# EAGLE design M040X (EAGLE 6.6.0)
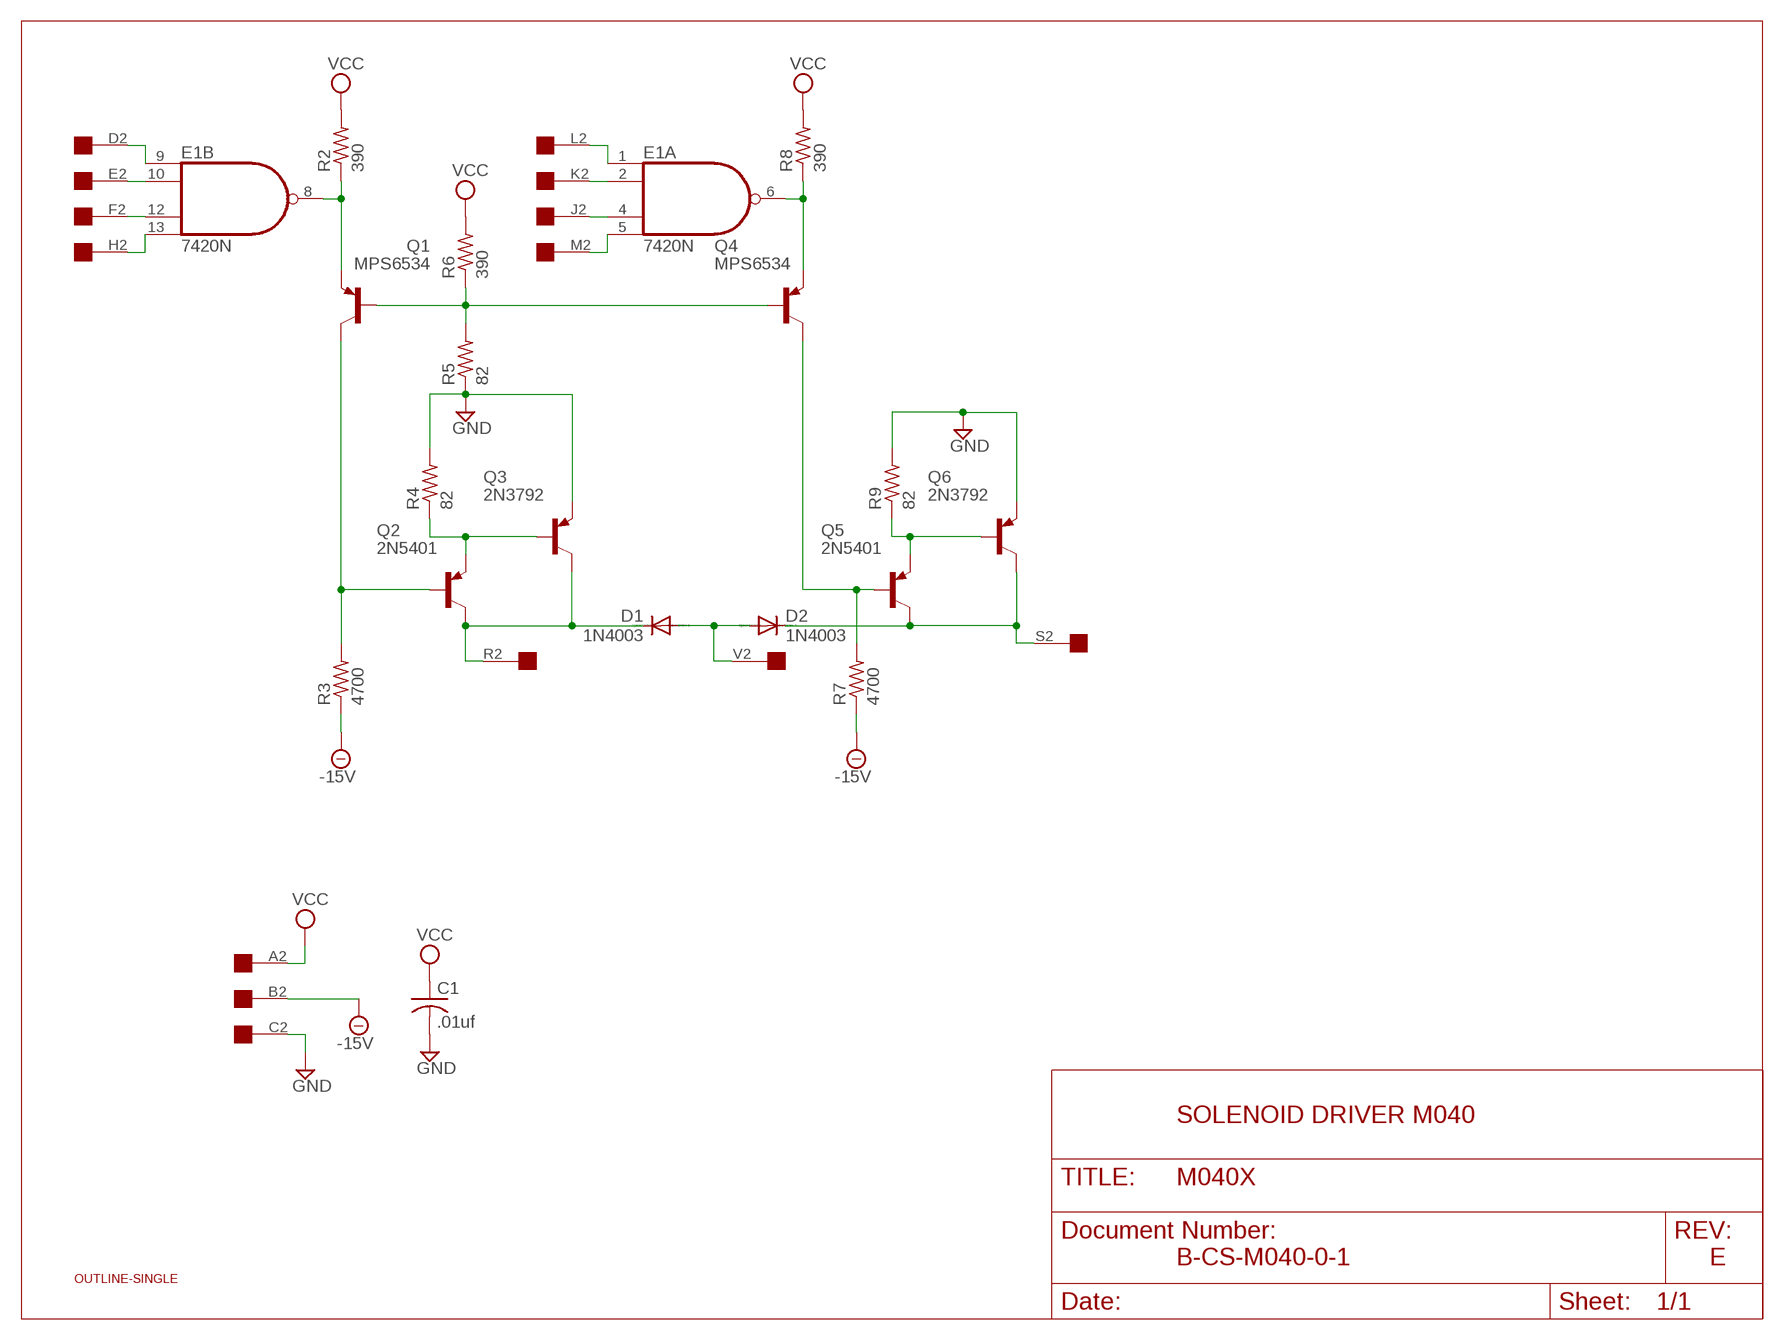
[diagram p0: schematic, sheet 1]

## Parts
C1  .01uf  C-US050-025X075  [C050-025X075]
D1  1N4003  1N4004  [DO41-10]
D2  1N4003  1N4004  [DO41-10]
E1  7420N  74S20N  [DIL14]
Q1  MPS6534  2N2904-PNP-TO39-EBC  [TO39]
Q2  2N5401  2N2904-PNP-TO39-EBC  [TO39]
Q3  2N3792  -PNP-TO3  [TO3]
Q4  MPS6534  2N2904-PNP-TO39-EBC  [TO39]
Q5  2N5401  2N2904-PNP-TO39-EBC  [TO39]
Q6  2N3792  -PNP-TO3  [TO3]
R2  390  R-US_0207/10  [0207/10]
R3  4700  R-US_0207/10  [0207/10]
R4  82  R-US_0207/10  [0207/10]
R5  82  R-US_0207/10  [0207/10]
R6  390  R-US_0207/10  [0207/10]
R7  4700  R-US_0207/10  [0207/10]
R8  390  R-US_0207/10  [0207/10]
R9  82  R-US_0207/10  [0207/10]
U$1  OUTLINE-SINGLE  [SINGLE]
U$2  EDGE-1  [EDGE-CON1]

## Nets
-15V [Supply]: R3.1 R7.1 U$2.B2
GND [Supply]: C1.2 Q3.E Q6.E R4.2 R5.1 R9.2 U$2.C2
N$1: E1.10(B:I1) U$2.E2
N$2: E1.12(B:I2) U$2.F2
N$3: E1.13(B:I3) U$2.H2
N$4: E1.9(B:I0) U$2.D2
N$5: E1.1(A:I0) U$2.L2
N$6: E1.2(A:I1) U$2.K2
N$7: E1.4(A:I2) U$2.J2
N$8: E1.5(A:I3) U$2.M2
N$9: E1.8(B:O) Q1.1(E) R2.1
N$10: Q1.2(B) Q4.2(B) R5.2 R6.1
N$11: E1.6(A:O) Q4.1(E) R8.1
N$12: Q1.3(C) Q2.2(B) R3.2
N$13: Q4.3(C) Q5.2(B) R7.2
N$14: Q2.1(E) Q3.B R4.1
N$16: D1.C Q2.3(C) Q3.C U$2.R2
N$17: Q5.1(E) Q6.B R9.1
N$18: D2.C Q5.3(C) Q6.C U$2.S2
N$19: D1.A D2.A U$2.V2
VCC [Supply]: C1.1 R2.2 R6.2 R8.2 U$2.A2
Unconnected: U$2.N2 U$2.P2 U$2.T2 U$2.U2

## Notes on the sheet
- SOLENOID DRIVER M040
- B-CS-M040-0-1 | E

## Power pins joined to a net without a drawn wire
GND: E1.7(P:GND)
VCC: E1.14(P:VCC)

## Library data of the parts
C1 = rcl:C-US: CAPACITOR, American symbol
D1 D2 = diode:1N4004: DIODE general purpose rectifier, 1 A
E1 = 74xx-us:74*20: Dual 4-input NAND gate
Q1-Q6 = transistor:*-PNP-: PNP Transistror
R2-R9 = rcl:R-US_: RESISTOR, American symbol
U$1 = dec-con:OUTLINE-*: Board outlines for DEC boards.
U$2 = dec-con:EDGE-1: Single-Sided DEC Edge Connector -- (side 2)

## Net classes
1 Supply: width 0.813 mm

## Board
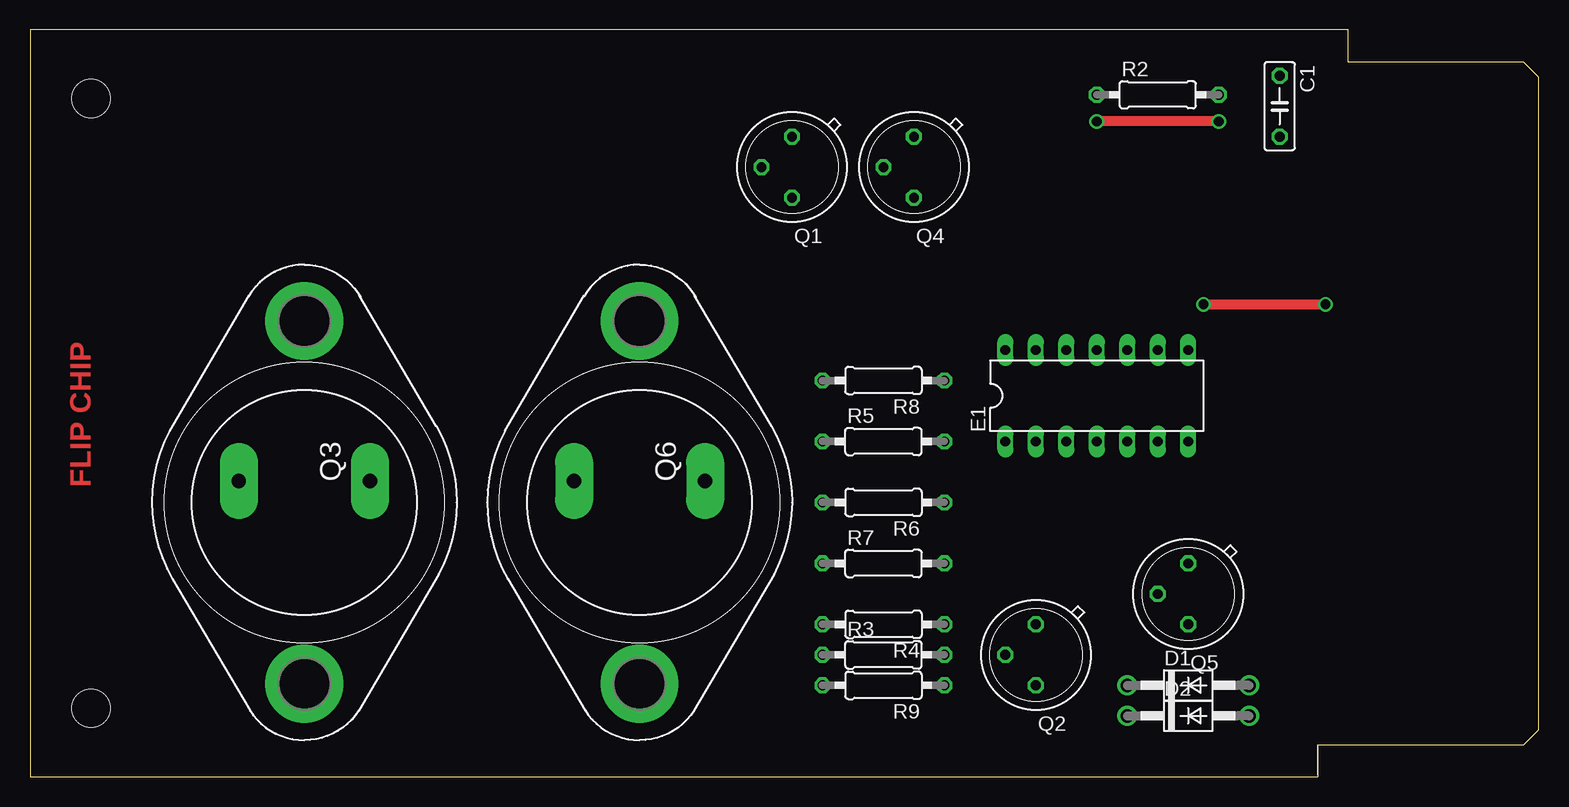
[diagram p1: board, top side]
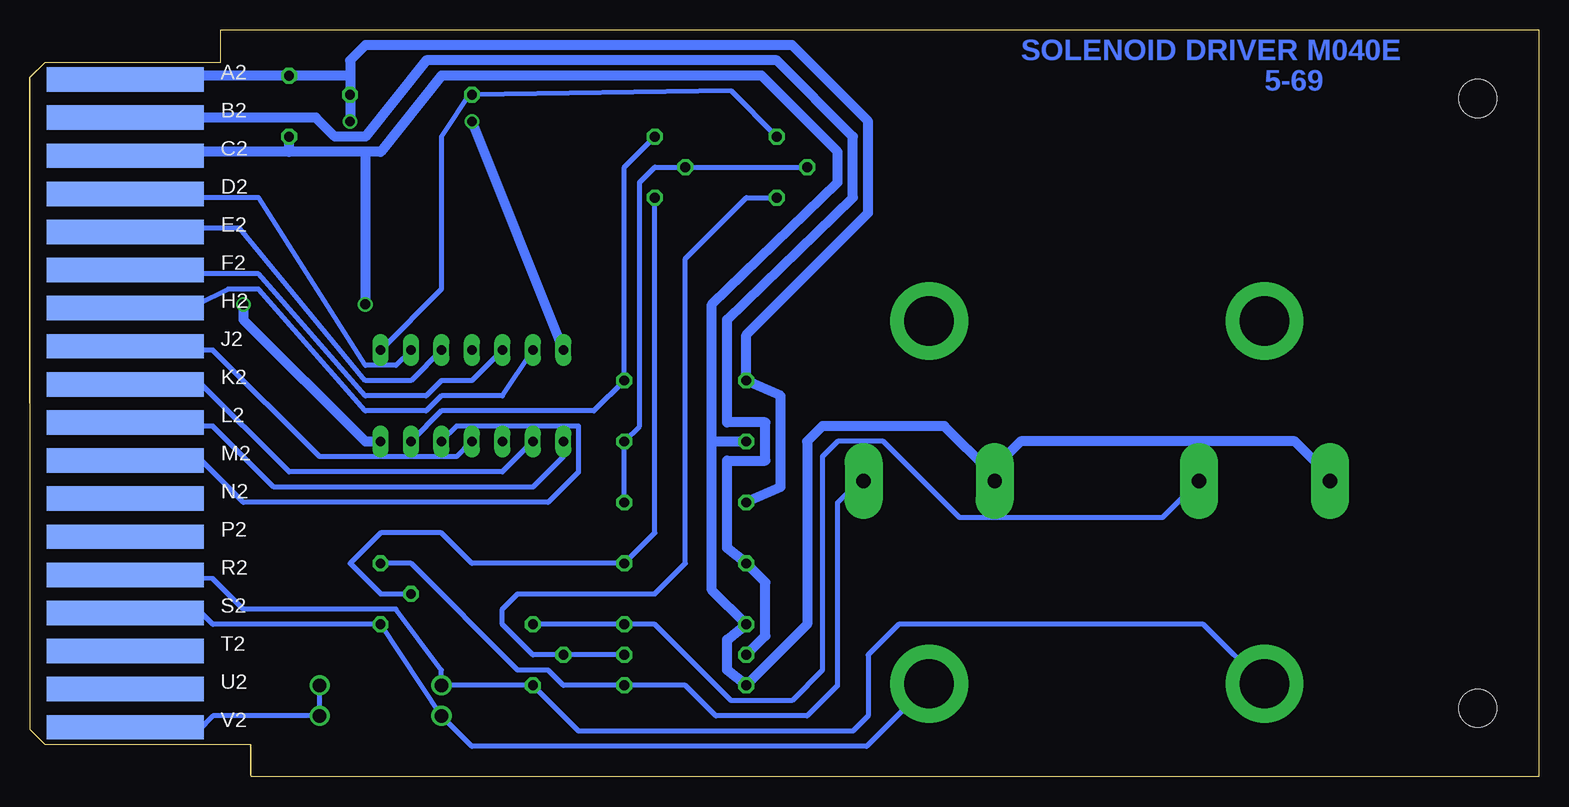
[diagram p2: board, bottom side, seen from below]

Size 125.73 x 62.23 mm. Coordinates in mm from the lower left corner, seen from the top.
Copper layers (1+16): Top 0.035mm / dielectric 1.5mm / Bottom 0.035mm
Design rules "16mils": minimum track width 16mil, minimum drill 32mil, track to track 15mil, track to pad 10mil, pad to pad 10mil, via to via 10mil, smd to smd 10mil, copper to edge 13mil, drill to drill 10mil, minimum pad ring 10mil, minimum via ring 8mil, stop-mask expansion 0mil, vias tented up to drill 0mil, thermal gap 10mil

### Footprints (pad centres in the part's own frame; a part is rotated, then mirrored left to right if it is on the bottom)
C050-025X075 = drill 0.813 octagon: 1 -2.54,0; 2 2.54,0
DO41-10 = drill 1.118: A 5.08,0; C -5.08,0
DIL14 = drill 0.813 long: 1 -7.62,-3.81; 2 -5.08,-3.81; 3 -2.54,-3.81; 4 0,-3.81; 5 2.54,-3.81; 6 5.08,-3.81; 7 7.62,-3.81; 8 7.62,3.81; 9 5.08,3.81; 10 2.54,3.81; 11 0,3.81; 12 -2.54,3.81; 13 -5.08,3.81; 14 -7.62,3.81
TO39 = drill 0.813 octagon: 1 0,-2.54; 2 2.54,0; 3 0,2.54
TO3 = drill 1.194 pad 3.15 long: B -1.778,5.461; E -1.778,-5.461 | drill 4.115 pad 6.477: C 15.113,0; C/ -15.113,0
0207/10 = drill 0.813 octagon: 1 -5.08,0; 2 5.08,0
SINGLE = hole 3.175: 120.65,56.515; 120.65,5.715
EDGE-CON1 = smd 13.106 x 2.032 bottom: A2 7.938,4.128; B2 7.938,7.303; C2 7.938,10.477; D2 7.938,13.652; E2 7.938,16.828; F2 7.938,20.003; H2 7.938,23.177; J2 7.938,26.352; K2 7.938,29.527; L2 7.938,32.703; M2 7.938,35.877; N2 7.938,39.053; P2 7.938,42.227; R2 7.938,45.403; S2 7.938,48.578; T2 7.938,51.752; U2 7.938,54.928; V2 7.938,58.102

### Placement (x,y rotation side)
C1  104.14,55.88 270 top
D1  96.52,7.62 0 top
D2  96.52,5.08 0 top
E1  88.9,31.75 0 top
Q1  63.5,50.8 180 top
Q2  83.82,10.16 180 top
Q3  22.86,22.86 270 top
Q4  73.66,50.8 180 top
Q5  96.52,15.24 180 top
Q6  50.8,22.86 270 top
R2  93.98,56.83 0 top
R3  71.12,10.16 0 top
R4  71.12,12.7 180 top
R5  71.12,27.94 0 top
R6  71.12,22.86 180 top
R7  71.12,17.78 0 top
R8  71.12,33.02 180 top
R9  71.12,7.62 180 top
U$1  125.73,62.23 180 top
U$2  125.73,62.23 180 top

### Tracks (layer width: path | path; a pad name or v marks a point on that pad's centre or on a via)
-15V
  Bottom 0.813: U$2.B2 112.08,54.93 101.92,54.93 100.33,53.34 97.79,53.34 92.71,59.69 63.5,59.69 57.15,53.34 57.15,48.26 67.63,38.1 67.63,29.53 64.45,29.53 64.45,26.35 67.63,26.35 67.63,19.05 R7.1 64.45,16.19 64.45,11.75 R3.1
GND  (via drill 0.81)
  Top 0.813: v97.79,39.37 v107.95,39.37
  Bottom 0.813: U$2.C2 111.76,51.74 111.76,52.07 104.14,52.07 | 45.72,25.4 49.53,29.21 59.69,29.21 60.96,27.94 60.96,12.7 R9.2 67.63,8.89 67.63,11.43 R4.2 68.9,15.56 68.9,27.94 | E1.7 97.79,27.94 107.95,38.1 v107.95,39.37 | 97.79,52.07 v97.79,39.37 | 104.14,52.07 C1.2 | 97.79,52.07 96.52,52.07 91.44,58.42 64.77,58.42 58.42,52.07 58.42,49.53 68.9,39.37 68.9,27.94 | 97.79,52.07 104.14,52.07 | 68.9,27.94 R5.1 | Q3.E 17.78,25.4 20.32,27.94 43.18,27.94 45.72,25.4 | Q6.E 45.72,25.4
N$1
  Bottom 0.406: U$2.E2 111.76,45.72 108.27,45.72 97.79,33.02 93.98,33.02 E1.10
N$2
  Bottom 0.406: U$2.F2 111.76,41.91 106.68,41.91 97.79,31.75 92.71,31.75 91.44,33.02 88.9,33.02 E1.12
N$3
  Bottom 0.406: U$2.H2 111.76,39.37 109.22,40.64 106.68,40.64 97.79,30.48 92.71,30.48 91.44,31.75 86.36,31.75 E1.13
N$4
  Bottom 0.406: E1.9 95.25,34.29 97.79,34.29 106.68,48.26 111.76,48.26 U$2.D2
N$5
  Bottom 0.406: U$2.L2 117.71,29.21 110.49,29.21 105.41,24.13 83.82,24.13 81.28,26.67 E1.1
N$6
  Bottom 0.406: U$2.K2 117.76,33.02 111.76,33.02 104.14,25.4 86.36,25.4 E1.2
N$7
  Bottom 0.406: U$2.J2 117.73,35.56 110.49,35.56 101.6,26.67 90.17,26.67 E1.4
N$8
  Bottom 0.406: U$2.M2 117.1,26.67 111.76,26.67 107.95,22.86 82.55,22.86 80.01,25.4 80.01,29.21 90.17,29.21 E1.5
N$9
  Bottom 0.406: E1.8 91.44,40.64 91.44,53.34 88.9,57.15 R2.1 67.31,57.15 Q1.1
N$10
  Bottom 0.406: R6.1 R5.2 74.93,29.21 74.93,49.53 73.66,50.8 Q4.2 Q1.2
N$11
  Bottom 0.406: Q4.1 76.2,50.8 R8.1 78.74,30.48 91.44,30.48 E1.6
N$12
  Bottom 0.406: R3.2 Q2.2 83.82,10.16 86.36,12.7 86.36,13.97 85.09,15.24 73.66,15.24 71.12,17.78 71.12,43.18 66.04,48.26 Q1.3
N$13
  Bottom 0.406: Q5.2 96.52,15.24 99.06,17.78 96.52,20.32 91.44,20.32 88.9,17.78 R7.2 73.66,20.32 Q4.3
N$14
  Bottom 0.406: Q2.1 R4.1 73.66,12.7 67.31,6.35 62.23,6.35 59.69,8.89 59.69,26.67 58.42,27.94 54.61,27.94 48.26,21.59 31.37,21.59 Q3.B
N$16
  Bottom 0.406: U$2.R2 110.49,16.51 107.95,13.97 95.25,13.97 91.44,8.89 D1.C Q2.3 80.01,3.81 57.15,3.81 55.88,5.08 55.88,10.16 53.34,12.7 27.94,12.7 25.4,10.16 Q3.C 22.86,7.62
N$17
  Bottom 0.406: Q5.1 93.98,17.78 85.09,8.89 82.55,8.89 81.28,7.62 R9.1 71.12,7.62 68.58,5.08 60.96,5.08 58.42,7.62 58.42,22.86 56.64,24.64 Q6.B
N$18
  Bottom 0.406: U$2.S2 111.76,13.97 110.49,12.7 Q5.3 D2.C 88.9,2.54 56.01,2.54 Q6.C
N$19
  Bottom 0.406: U$2.V2 117.75,3.81 111.76,3.81 110.49,5.08 D2.A D1.A
VCC  (via drill 0.81)
  Top 0.813: v99.06,54.61 v88.9,54.61
  Bottom 0.813: U$2.A2 112.14,58.04 111.76,58.42 C1.1 99.06,58.42 | v88.9,54.61 E1.14 | R6.2 63.18,24.13 63.18,31.75 R8.2 66.04,36.83 55.88,46.99 55.88,54.61 62.23,60.96 97.79,60.96 99.06,59.69 99.06,58.42 | v99.06,54.61 R2.2 99.06,58.42

### Text on the board
Top: FLIP CHIP
Bottom: SOLENOID DRIVER M040E | 5-69